# EAGLE design Thermocouple-Interface-5V (EAGLE 6.1)
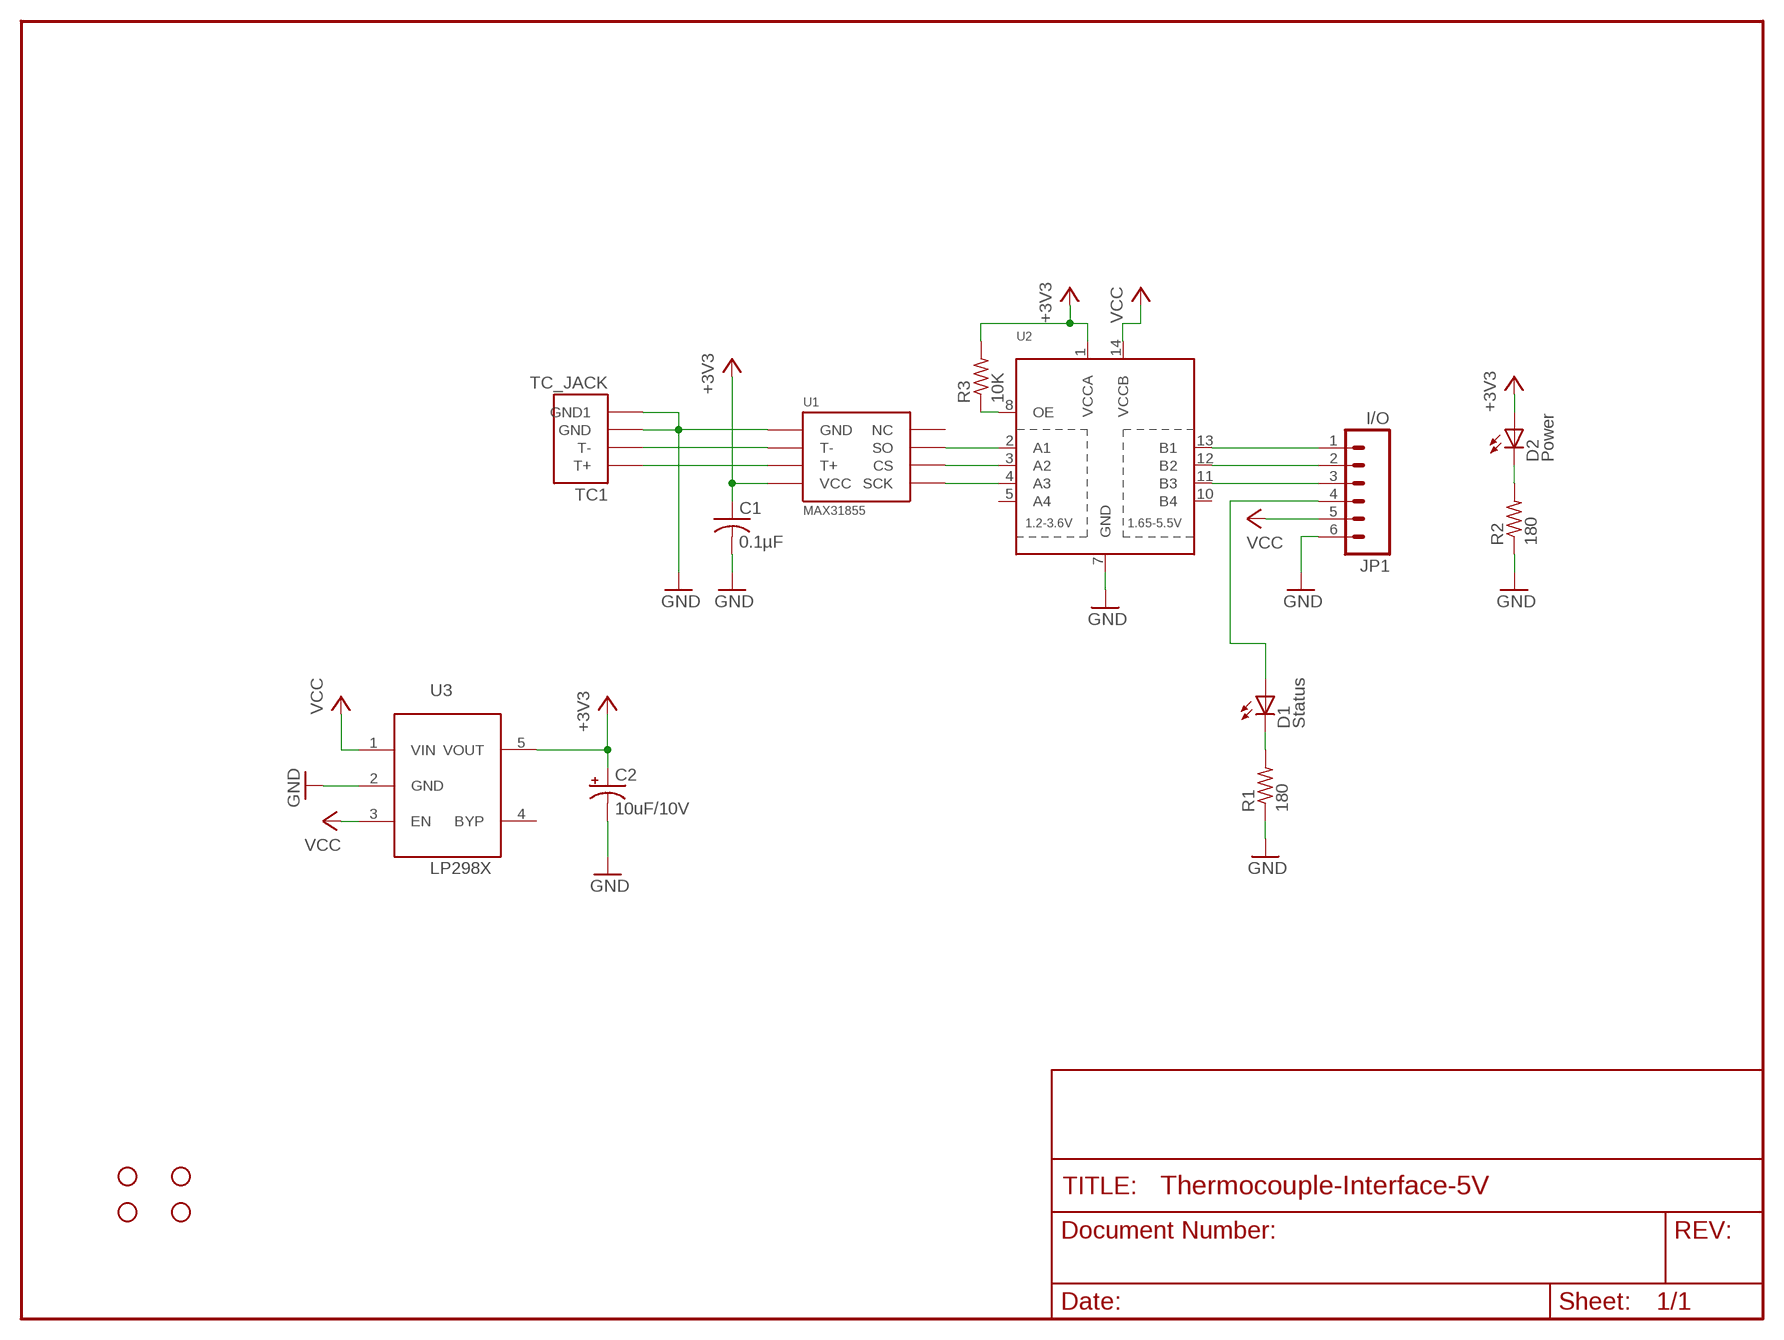
[diagram p0: schematic, sheet 1]

## Parts
C1  0.1µF  C-USC0603  [C0603]
C2  10uF/10V  CPOL-USA/3216-18R  [A/3216-18R]
D1  Status  LEDCHIP-LED0805  [CHIP-LED0805]
D2  Power  LEDCHIP-LED0805  [CHIP-LED0805]
JP1  I/O  M06SIP  [1X06]
R1  180  R-US_R0603  [R0603]
R2  180  R-US_R0603  [R0603]
R3  10K  R-US_R0603  [R0603]
TC1  TC_JACK  [TC_JACK]
U1  MAX31855  MAX6675MAX31855  [SOIC-8]
U2  TXB0104PWR  [TSSOP14]
U3  LP298XS  [SOT23-5L]
U$1  STAND-OFF  [STAND-OFF]
U$2  STAND-OFF  [STAND-OFF]
U$3  STAND-OFF  [STAND-OFF]
U$4  STAND-OFF  [STAND-OFF]

## Nets
+3V3: C1.1 C2.+ D2.A R3.2 U1.VCC U2.1(VCCA) U3.5(VOUT)
_CS: JP1.2 U2.12(B2)
_SCK: JP1.3 U2.11(B3)
_SO: JP1.1 U2.13(B1)
CS: U1.CS U2.3(A2)
GND: C1.2 C2.- JP1.6 R1.1 R2.1 TC1.P$1(GND) TC1.P$2(GND1) U1.GND U2.7(GND) U3.2(GND)
N$1: D1.C R1.2
N$2: D2.C R2.2
N$3: R3.1 U2.8(OE)
N$4: D1.A JP1.4
SCK: U1.SCK U2.4(A3)
SO: U1.SO U2.2(A1)
T+: TC1.T+ U1.T+
T-: TC1.T- U1.T-
VCC: JP1.5 U2.14(VCCB) U3.1(VIN) U3.3(EN)
Unconnected: U1.NC U2.5(A4) U2.10(B4) U3.4(BYP)

## Library data of the parts
C1 = resistor:C-US: CAPACITOR, American symbol
C2 = adafruit:CPOL-US: POLARIZED CAPACITOR, American symbol
D1 D2 = led:LED: LED OSRAM: - CHIPLED LG R971, LG N971, LY N971, LG Q971, LY Q971, LO R971, LY R971 LH N974, LH R974 LS Q976, LO Q976, LY Q976 LO Q996 - Hyper CHIPLED LW Q18S LB Q993, LB Q99A, LB R99A - SideLED LS A670, LO A670, LY A670, LG A670, LP A670 LB A673, LV A673, LT A673, LW A673 LH A674 LY A675 LS A676, LA A676, LO A676, LY A676, LW A676 LS A679, LY A679, LG A679 - Hyper Micro SIDELED® LS Y876, LA Y876, LO Y876, LY Y876 LT Y87S - SmartLED LW L88C, LW L88S LB L89C, LB L89S, LG L890 LS L89K, LO L89K, LY L89K LS L896, LA L896, LO L896, LY L896 - TOPLED LS T670, LO T670, LY T670, LG T670, LP T670 LSG T670, LSP T670, LSY T670, LOP T670, LYG T670 LG T671, LOG T671, LSG T671 LB T673, LV T673, LT T673, LW T673 LH T674 LS T676, LA T676, LO T676, LY T676, LB T676, LH T676, LSB T676, LW T676 LB T67C, LV T67C, LT T67C, LS T67K, LO T67K, LY T67K, LW E67C LS E67B, LA E67B, LO E67B, LY E67B, LB E67C, LV E67C, LT E67C LW T67C LS T679, LY T679, LG T679 LS T770, LO T770, LY T770, LG T770, LP T770 LB T773, LV T773, LT T773, LW T773 LH T774 LS E675, LA E675, LY E675, LS T675 LS T776, LA T776, LO T776, LY T776, LB T776 LHGB T686 LT T68C, LB T68C - Hyper Mini TOPLED® LB M676 - Mini TOPLED Santana® LG M470 LS M47K, LO M47K, LY M47K Source: http://www.osram.convergy.de LUXEON: - LUMILED® LXK2-PW12-R00, LXK2-PW12-S00, LXK2-PW14-U00, LXK2-PW14-V00 LXK2-PM12-R00, LXK2-PM12-S00, LXK2-PM14-U00 LXK2-PE12-Q00, LXK2-PE12-R00, LXK2-PE12-S00, LXK2-PE14-T00, LXK2-PE14-U00 LXK2-PB12-K00, LXK2-PB12-L00, LXK2-PB12-M00, LXK2-PB14-N00, LXK2-PB14-P00, LXK2-PB14-Q00 LXK2-PR12-L00, LXK2-PR12-M00, LXK2-PR14-Q00, LXK2-PR14-R00 LXK2-PD12-Q00, LXK2-PD12-R00, LXK2-PD12-S00 LXK2-PH12-R00, LXK2-PH12-S00 LXK2-PL12-P00, LXK2-PL12-Q00, LXK2-PL12-R00 Source: www.luxeon.com KINGBRIGHT: KA-3528ASYC Source: www.kingbright.com
JP1 = SparkFun:M06: Header 6 Standard 6-pin 0.1" header. Use with straight break away headers (SKU : PRT-00116), right angle break away headers (PRT-00553), swiss pins (PRT-00743), machine pins (PRT-00117), and female headers (PRT-00115). Molex polarized connector foot print use with SKU : PRT-08094 with associated crimp pins and housings. NOTES ON THE VARIANTS LOCK and LOCK_LONGPADS... This footprint was designed to help hold the alignment of a through-hole component (i.e. 6-pin header) while soldering it into place. You may notice that each hole has been shifted either up or down by 0.005 of an inch from it's more standard position (which is a perfectly straight line). This slight alteration caused the pins (the squares in the middle) to touch the edges of the holes. Because they are alternating, it causes a "brace" to hold the component in place. 0.005 has proven to be the perfect amount of "off-center" position when using our standard breakaway headers. Although looks a little odd when you look at the bare footprint, once you have a header in there, the alteration is very hard to notice. Also, if you push a header all the way into place, it is covered up entirely on the bottom side. This idea of altering the position of holes to aid alignment will be further integrated into the Sparkfun Library for other footprints. It can help hold any component with 3 or more connection pins.
R1-R3 = resistor:R-US_: RESISTOR, American symbol
TC1 = McLaughlinEng:TC_JACK
U1 = McLEng:MAX6675
U2 = McLEng:TXB0104PWR: 4-Bit Bi-Directional Level Shifter 1.2V-3.6V (VCCA) to 1.65V-5.5V (VCCB) bi-directional level shifter with auto direction sensing. Max data rate - VCCA 1.8V: 20Mbps (50ns), VCCA 3.3V: 100Mbps (10ns) Digikey: 296-21929-1-ND
U3 = adafruit:LP298X
U$1-U$4 = SparkFun:STAND-OFF: Stand Off This is the mechanical footprint for a #4 phillips button head screw. Use the keepout ring to avoid running the screw head into surrounding components. SKU : PRT-00447

## Board
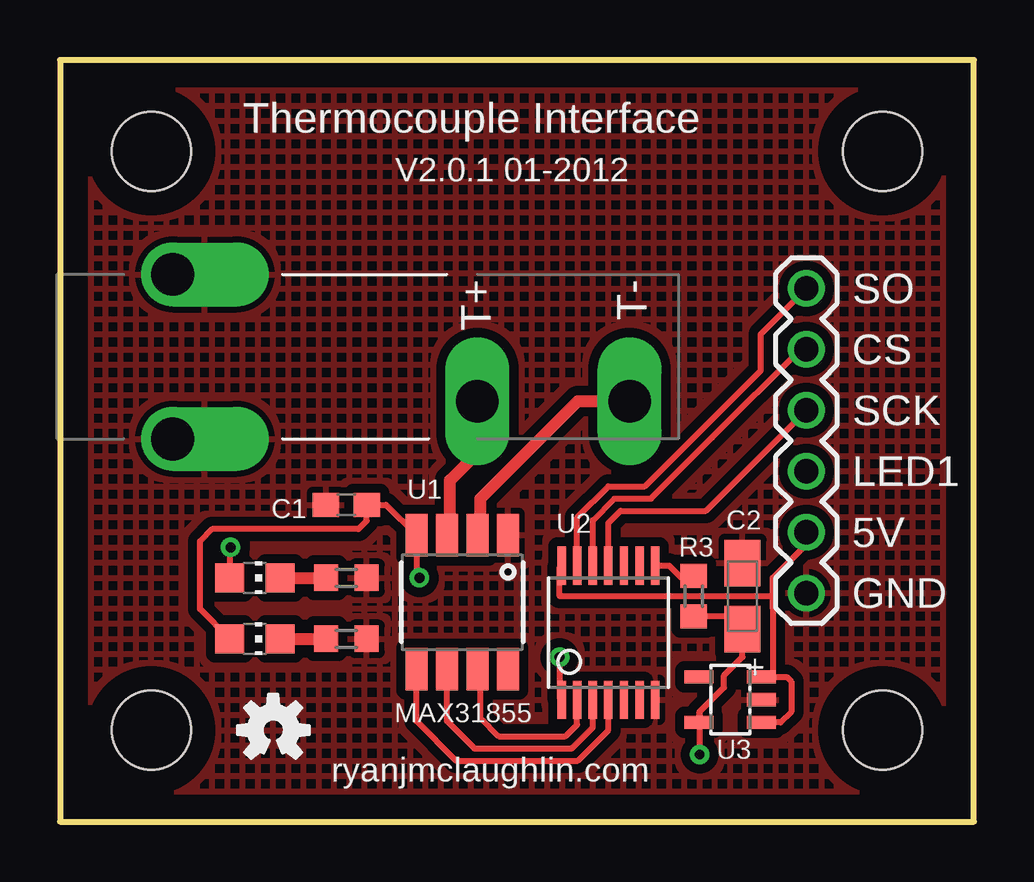
[diagram p1: board, top side]
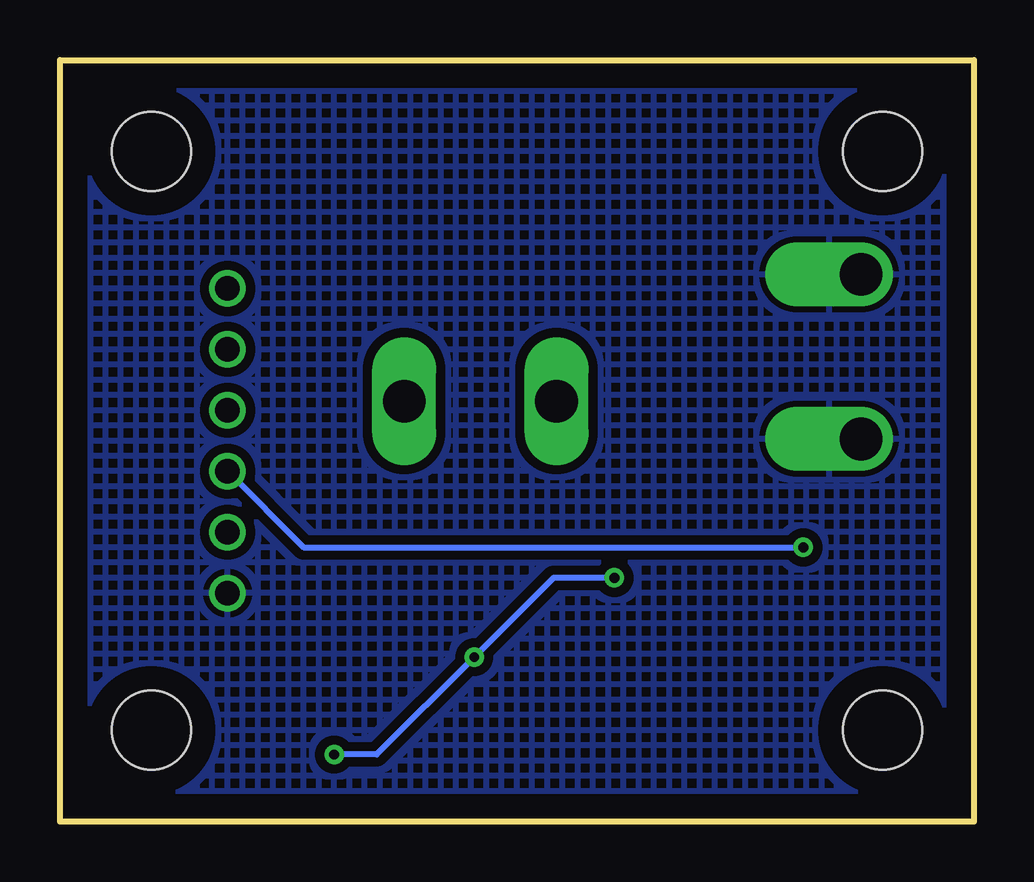
[diagram p2: board, bottom side, seen from below]

Size 38.1 x 31.75 mm. Coordinates in mm from the lower left corner, seen from the top.
Outline: 0,31.75 0,0 38.1,0 38.1,31.75 0,31.75
Copper layers (1*16): Top 0.035mm / dielectric 1.5mm / Bottom 0.035mm
Design rules: minimum track width 10mil, minimum drill 16mil, track to track 10mil, track to pad 10mil, pad to pad 8mil, via to via 8mil, smd to smd 8mil, copper to edge 40mil, drill to drill 10mil, minimum pad ring 10mil, minimum via ring 8mil, stop-mask expansion 4mil, vias tented up to drill 25mil, thermal gap 10mil

### Footprints (pad centres in the part's own frame; a part is rotated, then mirrored left to right if it is on the bottom)
C0603 = smd 1.1 x 1: 1 -0.85,0; 2 0.85,0
A/3216-18R = smd 1.95 x 1.5: + 1.375,0; - -1.375,0
CHIP-LED0805 = smd 1.2 x 1.2: A 0,-1.05; C 0,1.05
1X06 = drill 1.016: 1 0,0; 2 2.54,0; 3 5.08,0; 4 7.62,0; 5 10.16,0; 6 12.7,0
R0603 = smd 1 x 1.1: 1 -0.85,0; 2 0.85,0
TC_JACK = drill 1.778 offset: P$1 -5.283,0; P$2 1.575,0 | drill 1.778 long: T+ 0,12.7; T- 0,19.05
SOIC-8 = smd 1.778 x 0.914: CS 2.794,-0.635; GND -2.794,1.905; NC 2.794,1.905; SCK 2.794,-1.905; SO 2.794,0.635; T+ -2.794,-0.635; T- -2.794,0.635; VCC -2.794,-1.905
TSSOP14 = smd 0.35 x 1.6: 1 -1.95,-2.8; 2 -1.3,-2.8; 3 -0.65,-2.8; 4 0,-2.8; 5 0.65,-2.8; 6 1.3,-2.8; 7 1.95,-2.8; 8 1.95,2.8; 9 1.3,2.8; 10 0.65,2.8; 11 0,2.8; 12 -0.65,2.8; 13 -1.3,2.8; 14 -1.95,2.8
SOT23-5L = smd 0.55 x 1.2: 1 -0.95,-1.3; 2 0,-1.3; 3 0.95,-1.3; 4 0.95,1.3; 5 -0.95,1.3
STAND-OFF = hole 3.302: 0,0

### Placement (x,y rotation side)
C1  11.94,13.21 180 top
C2  28.45,9.4 270 top
D1  8.13,10.16 270 top
D2  8.13,7.62 270 top
JP1  31.11,22.23 270 top
R1  11.94,10.16 180 top
R2  11.94,7.62 180 top
R3  26.42,9.4 270 top
TC1  4.7,17.53 270 top
U1  16.76,9.14 270 top
U2  22.86,7.87 0 top
U3  27.94,5.08 90 top
U$1  34.29,27.94 270 top
U$2  3.81,27.94 270 top
U$3  34.29,3.81 270 top
U$4  3.81,3.81 270 top
U$5  [OSHW-LOGO-S]  8.89,3.81 0 top

### Tracks (layer width: path | path; a pad name or v marks a point on that pad's centre or on a via)
+3V3  (via drill 0.41 pad 0.81)
  Top 0.254: U2.1 20.83,5.16 v20.83,6.86 | v14.99,10.16 14.86,10.29 U1.VCC 13.59,13.21 C1.1 12.79,12.53 12.45,12.19 6.35,12.19 5.84,11.68 5.84,8.86 D2.A | 26.64,4.54 27.69,5.59 27.69,6.1 28.45,6.86 C2.+ 27.92,8.55 R3.2 | 26.64,4.54 U3.5 | 26.64,4.54 26.67,4.51 v26.67,2.79
  Bottom 0.254: v14.99,10.16 17.53,10.16 v20.83,6.86 24.89,2.79 v26.67,2.79
_CS
  Top 0.254: U2.12 22.21,12.56 23.11,13.46 24.64,13.46 27.18,16 30.86,19.68 JP1.2
_SCK
  Top 0.254: U2.11 22.86,12.45 23.37,12.95 26.92,12.95 JP1.3
_SO
  Top 0.254: U2.13 21.56,12.67 22.86,13.97 24.38,13.97 29.21,18.8 29.21,20.32 JP1.1
CS
  Top 0.254: U1.CS 16.13,4.19 17.27,3.05 21.34,3.05 22.21,3.92 U2.3
GND
  pour Top (isolate 0.381, hatched): 38.1,31.75 38.1,0 0,0 0,31.75
  pour Bottom (isolate 0.381, hatched): 38.1,31.75 38.1,0 0,0 0,31.75
N$1
  Top 0.508: D1.C R1.2
N$2
  Top 0.508: D2.C R2.2
N$3
  Top 0.254: U2.8 25.39,10.67 25.91,10.16 26.33,10.16 R3.1
N$4  (via drill 0.41 pad 0.81)
  Top 0.254: v7.11,11.43 7.08,11.4 D1.A
  Bottom 0.254: JP1.4 27.94,11.43 v7.11,11.43
SCK
  Top 0.254: U1.SCK 14.86,4.19 16.51,2.54 21.59,2.54 22.86,3.81 U2.4
SO
  Top 0.254: U2.2 21.56,4.03 21.08,3.56 18.29,3.56 17.53,4.32 17.53,6.22 U1.SO
T+
  Top 0.508: U1.T+ 16.26,12.06 16.26,14.22 17.4,15.37 TC1.T+
T-
  Top 0.508: U1.T- 17.53,12.06 17.53,13.46 21.59,17.53 TC1.T-
VCC
  Top 0.254: U3.1 30.04,4.13 30.48,4.57 30.48,5.84 30.29,6.03 U3.3 29.24,6.1 29.72,6.1 29.72,8.89 | U2.14 20.83,10.59 20.83,9.4 29.24,9.4 29.72,9.4 29.72,8.89 | JP1.5 31.11,11.56 29.72,10.16 29.72,8.89

### Text on the board
tPlace: Thermocouple Interface | V2.0.1 01-2012 | SO | CS | SCK | LED1 | 5V | GND | ryanjmclaughlin.com
tNames: U1